# Altium schematic sheet Filter.SchDoc
size A; SheetNumber: 2; SheetTotal: 3
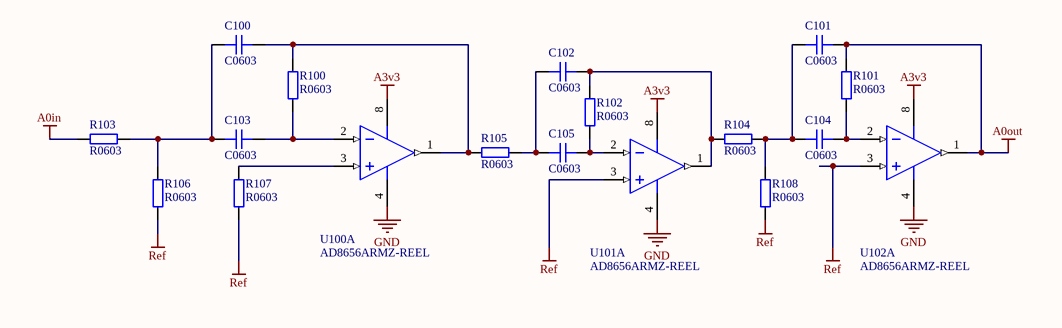
[diagram p0: Filter.SchDoc]

## Parts
C100  C0603  [CAP_0603]
C101  C0603  [CAP_0603]
C102  C0603  [CAP_0603]
C103  C0603  [CAP_0603]
C104  C0603  [CAP_0603]
C105  C0603  [CAP_0603]
R100  R0603  [RES_0603]
R101  R0603  [RES_0603]
R102  R0603  [RES_0603]
R103  R0603  [RES_0603]
R104  R0603  [RES_0603]
R105  R0603  [RES_0603]
R106  R0603  [RES_0603]
R107  R0603  [RES_0603]
R108  R0603  [RES_0603]
U100  AD8656ARMZ-REEL  [ADI-RM-8_N]  (part A of 2)
U101  AD8656ARMZ-REEL  [ADI-RM-8_N]  (part A of 2)
U102  AD8656ARMZ-REEL  [ADI-RM-8_N]  (part A of 2)

## Nets
A0in: R103.2
A0out: C101.2 R101.2 U102.1(OUT_A)
A3v3: U100.8(+V) U101.8(+V) U102.8(+V)
GND: U100.4(-V) U101.4(-V) U102.4(-V)
Ref: R106.2 R107.1 R108.1 U101.3(+IN_A) U102.3(+IN_A)
NetC100_1: C100.1 C103.1 R103.1 R106.1
NetC100_2: C100.2 R100.2 R105.2 U100.1(OUT_A)
NetC101_1: C101.1 C104.1 R104.1 R108.2
NetC102_1: C102.1 C105.1 R105.1
NetC102_2: C102.2 R102.2 R104.2 U101.1(OUT_A)
NetC103_2: C103.2 R100.1 U100.2(-IN_A)
NetC104_2: C104.2 R101.1 U102.2(-IN_A)
NetC105_2: C105.2 R102.1 U101.2(-IN_A)
NetR107_2: R107.2 U100.3(+IN_A)

## Library data of the parts
C100-C105 = CAP_0603: Capacitor SMD 0603; Manufacturer: *; Manufacturer Part Number: *; Distributor Link: *; LCSC: *; Rating: *; Dielectric: *
R100-R108 = RES_0603: Resistor SMD 0603; Manufacturer: *; Manufacturer Part Number: *; Distributor Link: *; LCSC: *
U100-U102 = CMP-0384-01673-1: Double Channel RRIO Operational Amplifier, 28 MHz BW, 11 V/us SR, Industrial, 8-pin SOP (RM-8), Reel; Generic Part Number: AD8656; Manufacturer: Analog Devices; Input Bias Current: 1pA; Automotive Qualified: Yes; V Span Min: 2.7V; Iq/Amp: 4.5mA; Slew Rate: 11V/us; Input Offset Voltage: 50uV; Small Signal Bandwidth: 28MHz; V Span Max: 5.5V; Amplifiers Per Package: 2; ComponentLink3Description: Package Specification; ComponentLink2Description: Datasheet; Mounting Technology: Surface Mount; Code_JEDEC: MO-187-AA; PackageReference: RM-8; ComponentLink2URL: http://www.analog.com/static/imported-files/data_sheets/AD8655_8656.pdf; DatasheetVersion: Rev. B; ComponentLink1URL: http://www.analog.com/en/index.html; PartNumber: AD8656ARMZ-REEL; ComponentLink1Description: Manufacturer URL; ComponentLink3URL: http://www.analog.com/static/imported-files/packages/PKG_PDF/MSOP%28RM%29/RM_8.pdf; PackageDescription: 8-Pin Mini Small Outline Package, Body 3 x 3 mm, Pitch 0.65 mm